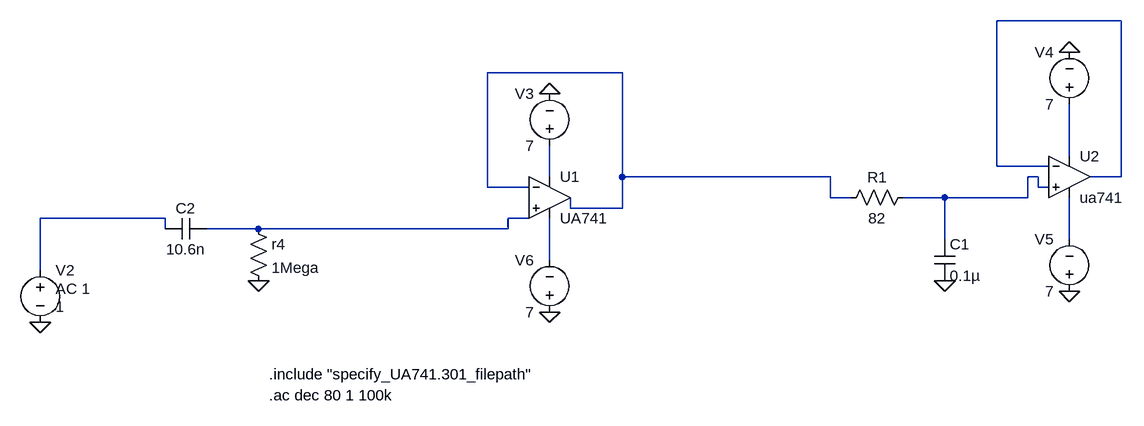
[diagram p0: schematic bandpass.asc]
bandpass.asc, the LTspice schematic file:
Version 4
SHEET 1 1660 680
WIRE 1376 -208 1184 -208
WIRE 608 -128 400 -128
WIRE 1296 0 1296 -80
WIRE 1184 16 1184 -208
WIRE 1264 16 1184 16
WIRE 496 32 496 -16
WIRE 608 32 608 -128
WIRE 928 32 608 32
WIRE 1248 32 1232 32
WIRE 1376 32 1376 -208
WIRE 1376 32 1328 32
WIRE 400 48 400 -128
WIRE 464 48 400 48
WIRE 1248 48 1248 32
WIRE 1264 48 1248 48
WIRE 928 64 928 32
WIRE 960 64 928 64
WIRE 1104 64 1040 64
WIRE 1232 64 1232 32
WIRE 1232 64 1104 64
WIRE 528 80 528 64
WIRE 608 80 608 32
WIRE 608 80 528 80
WIRE -96 96 -288 96
WIRE 464 96 464 80
WIRE 464 96 432 96
WIRE -96 112 -96 96
WIRE 48 112 -32 112
WIRE 432 112 432 96
WIRE 432 112 48 112
WIRE 1104 128 1104 64
WIRE 1296 128 1296 64
WIRE 496 160 496 96
WIRE -288 176 -288 96
FLAG 1104 192 0
FLAG 1296 -160 0
FLAG 1296 208 0
FLAG 496 -96 0
FLAG 496 240 0
FLAG -288 256 0
FLAG 48 192 0
SYMBOL res 1056 48 R90
WINDOW 0 0 56 VBottom 2
WINDOW 3 32 56 VTop 2
SYMATTR InstName R1
SYMATTR Value 82
SYMBOL cap 1088 128 R0
SYMATTR InstName C1
SYMATTR Value 0.1µ
SYMBOL OpAmps\\opamp2 1296 -32 R0
SYMATTR InstName U2
SYMATTR Value ua741
SYMBOL voltage 1296 -64 R180
WINDOW 0 24 96 Left 2
WINDOW 3 24 16 Left 2
WINDOW 123 0 0 Left 0
WINDOW 39 0 0 Left 0
SYMATTR InstName V4
SYMATTR Value 7
SYMBOL voltage 1296 224 R180
WINDOW 0 24 96 Left 2
WINDOW 3 24 16 Left 2
WINDOW 123 0 0 Left 0
WINDOW 39 0 0 Left 0
SYMATTR InstName V5
SYMATTR Value 7
SYMBOL voltage -288 160 R0
WINDOW 123 24 44 Left 2
WINDOW 39 0 0 Left 0
WINDOW 3 24 72 Left 2
SYMATTR Value2 AC 1
SYMATTR Value 1
SYMATTR InstName V2
SYMBOL cap -32 96 R90
WINDOW 0 0 32 VBottom 2
WINDOW 3 32 32 VTop 2
SYMATTR InstName C2
SYMATTR Value 10.6n
SYMBOL OpAmps\\opamp2 496 0 R0
SYMATTR InstName U1
SYMATTR Value UA741
SYMBOL voltage 496 0 R180
WINDOW 0 24 96 Left 2
WINDOW 3 24 16 Left 2
WINDOW 123 0 0 Left 0
WINDOW 39 0 0 Left 0
SYMATTR InstName V3
SYMATTR Value 7
SYMBOL voltage 496 256 R180
WINDOW 0 24 96 Left 2
WINDOW 3 24 16 Left 2
WINDOW 123 0 0 Left 0
WINDOW 39 0 0 Left 0
SYMATTR InstName V6
SYMATTR Value 7
SYMBOL res 32 96 R0
SYMATTR InstName r4
SYMATTR Value 1Mega
TEXT 64 336 Left 2 !.include "specify_UA741.301_filepath"
TEXT 64 368 Left 2 !.ac dec 80 1 100k

The netlist it stands for:
* bandpass.asc
R1 N005 N002 82
C1 N005 0 0.1µ
XU2 N005 N001 N003 N008 N001 ua741  ; pins In+ In- V+ V- OUT
V4 N003 0 7
V5 0 N008 7
V2 N006 0 1 AC 1
C2 N007 N006 10.6n
XU1 N007 N002 N004 N009 N002 UA741  ; pins In+ In- V+ V- OUT
V3 N004 0 7
V6 0 N009 7
r4 N007 0 1Mega
.include "specify_UA741.301_filepath"
.ac dec 80 1 100k
.backanno
.end